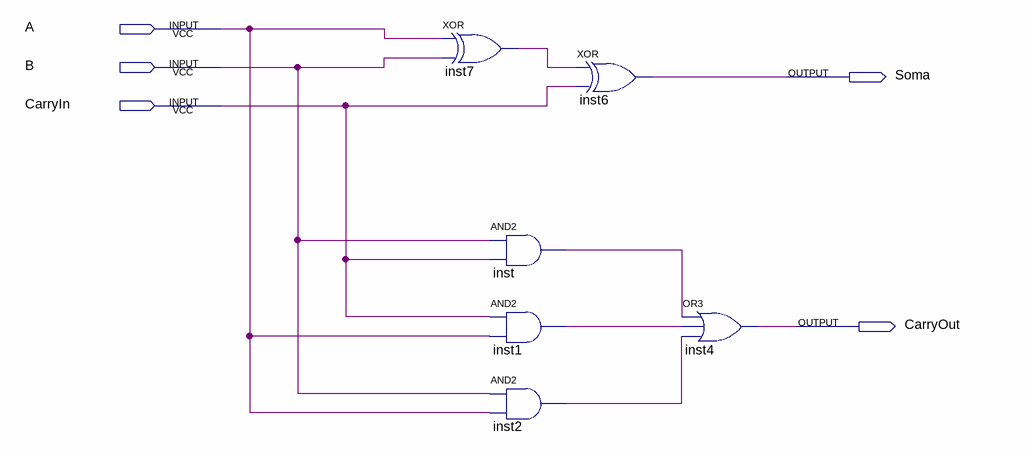
[diagram p0: schematic sheet]
// Quartus schematic Sum.bdf as structural Verilog: 6 symbols, 5 pins
module Sum (
  input  A,
  input  B,
  input  CarryIn,
  output Soma,
  output CarryOut
);

  wire inst1_out, inst2_out, inst7_out, inst_out;

  xor inst7 (inst7_out, A, B);
  and inst (inst_out, B, CarryIn);
  and inst1 (inst1_out, CarryIn, A);
  and inst2 (inst2_out, B, A);
  xor inst6 (Soma, inst7_out, CarryIn);
  or inst4 (CarryOut, inst_out, inst1_out, inst2_out);
endmodule
